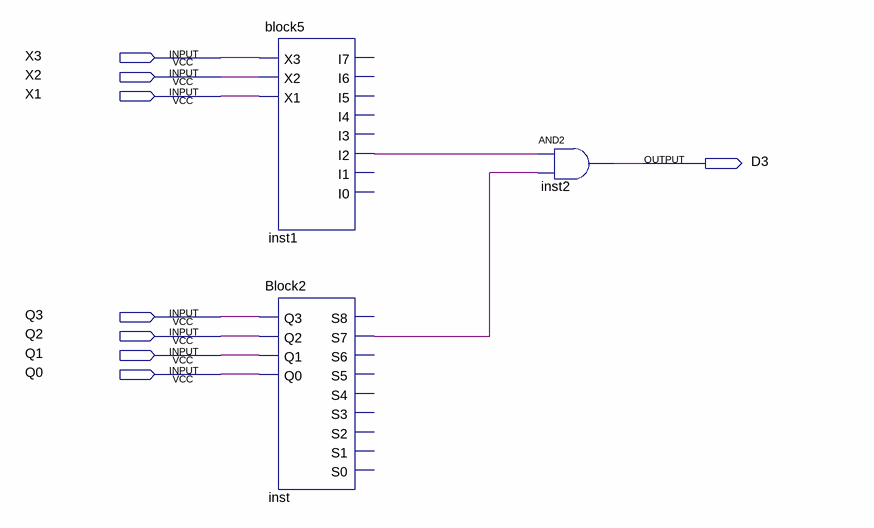
[diagram p0: schematic sheet]
// Quartus schematic block6.bdf as structural Verilog: 3 symbols, 8 pins
module block6 (
  input  X3,
  input  X2,
  input  X1,
  input  Q3,
  input  Q2,
  input  Q1,
  input  Q0,
  output D3
);

  wire inst1_i2, inst_s7;

  block5 inst1 (.X3(X3), .X2(X2), .X1(X1), .I2(inst1_i2));  // open: I7, I6, I5, I4, I3, I1, I0
  Block2 inst (.Q3(Q3), .Q2(Q2), .Q1(Q1), .Q0(Q0), .S7(inst_s7));  // open: S8, S6, S5, S4, S3, S2, S1, S0
  and inst2 (D3, inst1_i2, inst_s7);
endmodule
